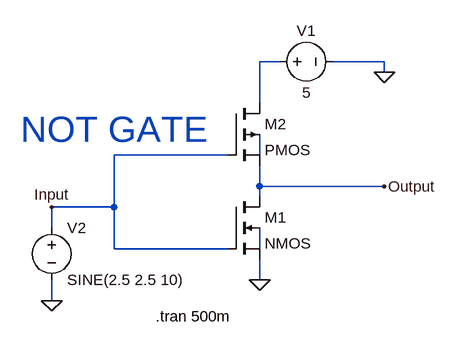
[diagram p0: schematic Not gate.asc]
Not gate.asc, the LTspice schematic file:
Version 4
SHEET 1 880 680
WIRE 256 -160 224 -160
WIRE 416 -160 336 -160
WIRE 416 -144 416 -160
WIRE 224 -96 224 -160
WIRE 176 -16 0 -16
WIRE 224 -16 224 -48
WIRE 224 32 224 0
WIRE 416 32 224 32
WIRE 224 48 224 32
WIRE 0 64 0 -16
WIRE 0 64 -96 64
WIRE -96 96 -96 64
WIRE 0 128 0 64
WIRE 176 128 0 128
WIRE 224 128 224 96
WIRE 224 176 224 144
WIRE -96 208 -96 176
FLAG 224 176 0
FLAG 416 -144 0
FLAG -96 208 0
FLAG -96 64 Input
FLAG 416 32 Output
SYMBOL nmos4 176 48 R0
SYMATTR InstName M1
SYMBOL pmos4 176 -96 R0
SYMATTR InstName M2
SYMBOL voltage 240 -160 R270
WINDOW 0 32 56 VTop 2
WINDOW 3 -32 56 VBottom 2
WINDOW 123 0 0 Left 0
WINDOW 39 0 0 Left 0
SYMATTR InstName V1
SYMATTR Value 5
SYMBOL voltage -96 80 R0
WINDOW 123 0 0 Left 0
WINDOW 39 0 0 Left 0
SYMATTR InstName V2
SYMATTR Value SINE(2.5 2.5 10)
TEXT 64 232 Left 2 !.tran 500m
TEXT 0 -56 Center 5 ;NOT GATE

The netlist it stands for:
* Not gate.asc
M1 Output Input 0 N003 NMOS
M2 N001 Input Output N002 PMOS
V1 N001 0 5
V2 Input 0 SINE(2.5 2.5 10)
.model NMOS NMOS
.model PMOS PMOS
.lib standard.mos
.tran 500m
* NOT GATE
.backanno
.end